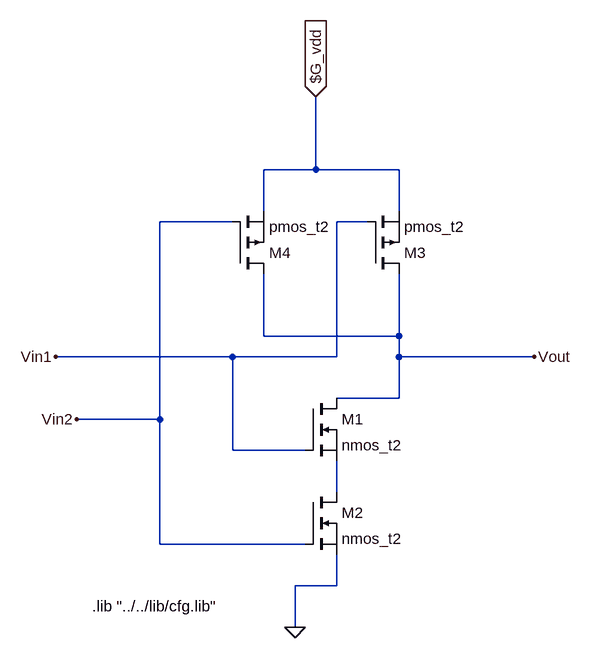
[diagram p0: schematic NAND_2.asc]
NAND_2.asc, the LTspice schematic file:
Version 4
SHEET 1 1096 680
WIRE 304 -224 304 -336
WIRE 304 -224 224 -224
WIRE 432 -224 304 -224
WIRE 224 -160 224 -224
WIRE 432 -160 432 -224
WIRE 176 -144 64 -144
WIRE 384 -144 336 -144
WIRE 224 32 224 -64
WIRE 432 32 432 -64
WIRE 432 32 224 32
WIRE 176 64 -96 64
WIRE 336 64 336 -144
WIRE 336 64 176 64
WIRE 432 64 432 32
WIRE 640 64 432 64
WIRE 432 128 432 64
WIRE 432 128 336 128
WIRE 64 160 64 -144
WIRE 64 160 -64 160
WIRE 176 208 176 64
WIRE 288 208 176 208
WIRE 336 272 336 224
WIRE 64 352 64 160
WIRE 288 352 64 352
WIRE 336 416 336 368
WIRE 336 416 272 416
WIRE 272 480 272 416
FLAG 272 480 0
FLAG 640 64 Vout
FLAG -64 160 Vin2
FLAG 304 -336 $G_vdd
IOPIN 304 -336 In
FLAG -96 64 Vin1
SYMBOL nmos 288 128 R0
SYMATTR InstName M1
SYMATTR Value nmos_t2
SYMATTR Prefix X
SYMBOL pmos 176 -64 M180
SYMATTR InstName M4
SYMATTR Value pmos_t2
SYMATTR Prefix X
SYMBOL pmos 384 -64 M180
SYMATTR InstName M3
SYMATTR Value pmos_t2
SYMATTR Prefix X
SYMBOL nmos 288 272 R0
SYMATTR InstName M2
SYMATTR Value nmos_t2
SYMATTR Prefix X
TEXT -40 448 Left 2 !.lib "../../lib/cfg.lib"

The netlist it stands for:
* NAND_2.asc
XM1 Vout Vin1 N001 nmos_t2  ; pins D G S
XM4 Vout Vin2 $G_vdd pmos_t2  ; pins D G S
XM3 Vout Vin1 $G_vdd pmos_t2  ; pins D G S
XM2 N001 Vin2 0 nmos_t2  ; pins D G S
.lib "../../lib/cfg.lib"
.backanno
.end